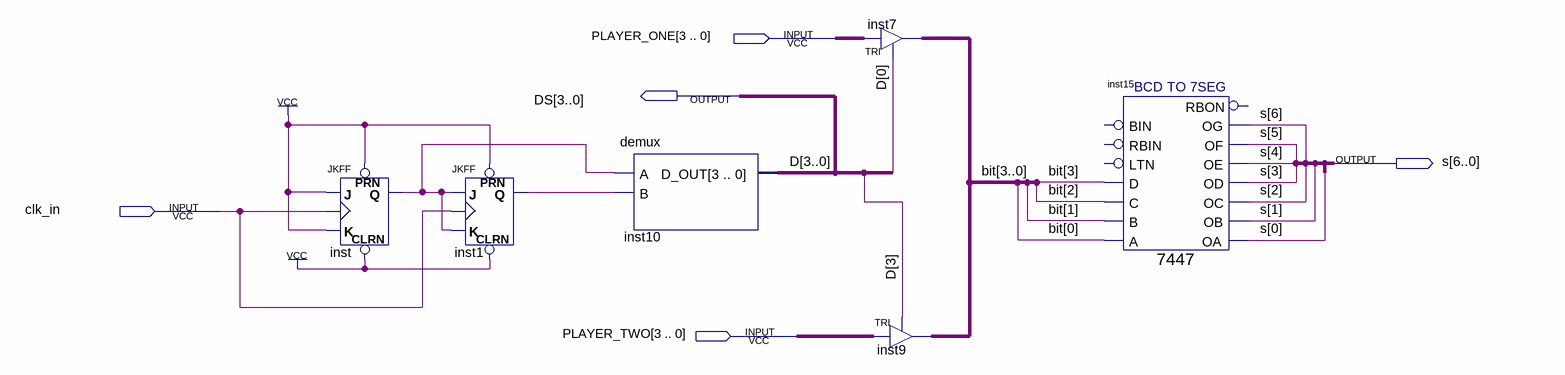
[diagram p0: schematic sheet]
// Quartus schematic seven_segment.bdf as structural Verilog: 6 symbols, 5 pins
module seven_segment (
  input  [3:0] PLAYER_ONE,
  input  clk_in,
  input  [3:0] PLAYER_TWO,
  output [3:0] DS,
  output [6:0] s
);

  wire inst1_q, inst_q;
  wire [3:0] \bit ;

  JKFF inst (.PRN(1'b1), .CLRN(1'b1), .K(1'b1), .J(1'b1), .CLK(clk_in), .Q(inst_q));
  JKFF inst1 (.PRN(1'b1), .CLRN(1'b1), .K(inst_q), .J(inst_q), .CLK(clk_in), .Q(inst1_q));
  demux inst10 (.A(inst_q), .B(inst1_q), .D_OUT(DS));
  TRI inst7[3:0] (.IN(PLAYER_ONE), .OE(DS[0]), .OUT(\bit ));
  TRI inst9[3:0] (.IN(PLAYER_TWO), .OE(DS[3]), .OUT(\bit ));
  \7447  inst15 (
    .B(\bit [1]), .C(\bit [2]), .D(\bit [3]), .A(\bit [0]), .OB(s[1]), .OC(s[2]), .OE(s[4]), .OD(s[3]),
    .OF(s[5]), .OG(s[6]), .OA(s[0]));  // open: LTN, RBIN, BIN, RBON

  // Other names for the same wires on the sheet: D[3:0] = DS
endmodule
